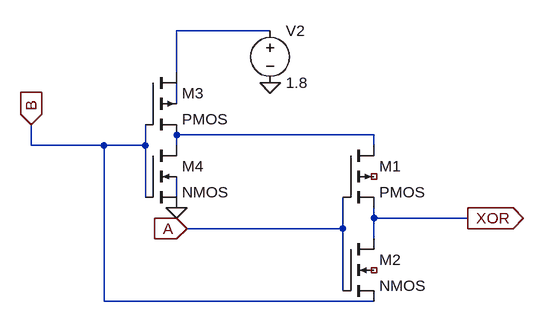
[diagram p0: schematic XOR_GDI.asc]
XOR_GDI.asc, the LTspice schematic file:
Version 4
SHEET 1 880 680
WIRE 144 -16 0 -16
WIRE 0 48 0 -16
WIRE 0 96 0 64
WIRE 304 144 0 144
WIRE -224 160 -224 128
WIRE -112 160 -224 160
WIRE -48 160 -48 128
WIRE -48 160 -112 160
WIRE 0 160 0 144
WIRE 304 160 304 144
WIRE -48 240 -48 160
WIRE 0 240 0 208
WIRE 304 272 304 256
WIRE 448 272 304 272
WIRE 256 288 256 240
WIRE 256 288 16 288
WIRE 304 304 304 272
WIRE 256 384 256 288
WIRE -112 400 -112 160
WIRE 304 400 -112 400
FLAG -224 128 B
IOPIN -224 128 In
FLAG 144 64 0
FLAG 0 256 0
FLAG 16 288 A
IOPIN 16 288 In
FLAG 448 272 XOR
IOPIN 448 272 Out
SYMBOL pmos4 256 160 R0
SYMATTR InstName M1
SYMBOL nmos4 256 304 R0
SYMATTR InstName M2
SYMBOL pmos4 -48 48 R0
SYMATTR InstName M3
SYMBOL nmos4 -48 160 R0
SYMATTR InstName M4
SYMBOL voltage 144 -32 R0
WINDOW 123 0 0 Left 0
WINDOW 39 0 0 Left 0
SYMATTR InstName V2
SYMATTR Value 1.8

The netlist it stands for:
* XOR_GDI.asc
M1 N003 A XOR NC_01 PMOS
M2 XOR A B NC_02 NMOS
M3 N001 B N003 N002 PMOS
M4 N003 B 0 N004 NMOS
V2 N001 0 1.8
.model NMOS NMOS
.model PMOS PMOS
.lib standard.mos
.backanno
.end